# Altium schematic sheet microPower1.SchDoc
size A4
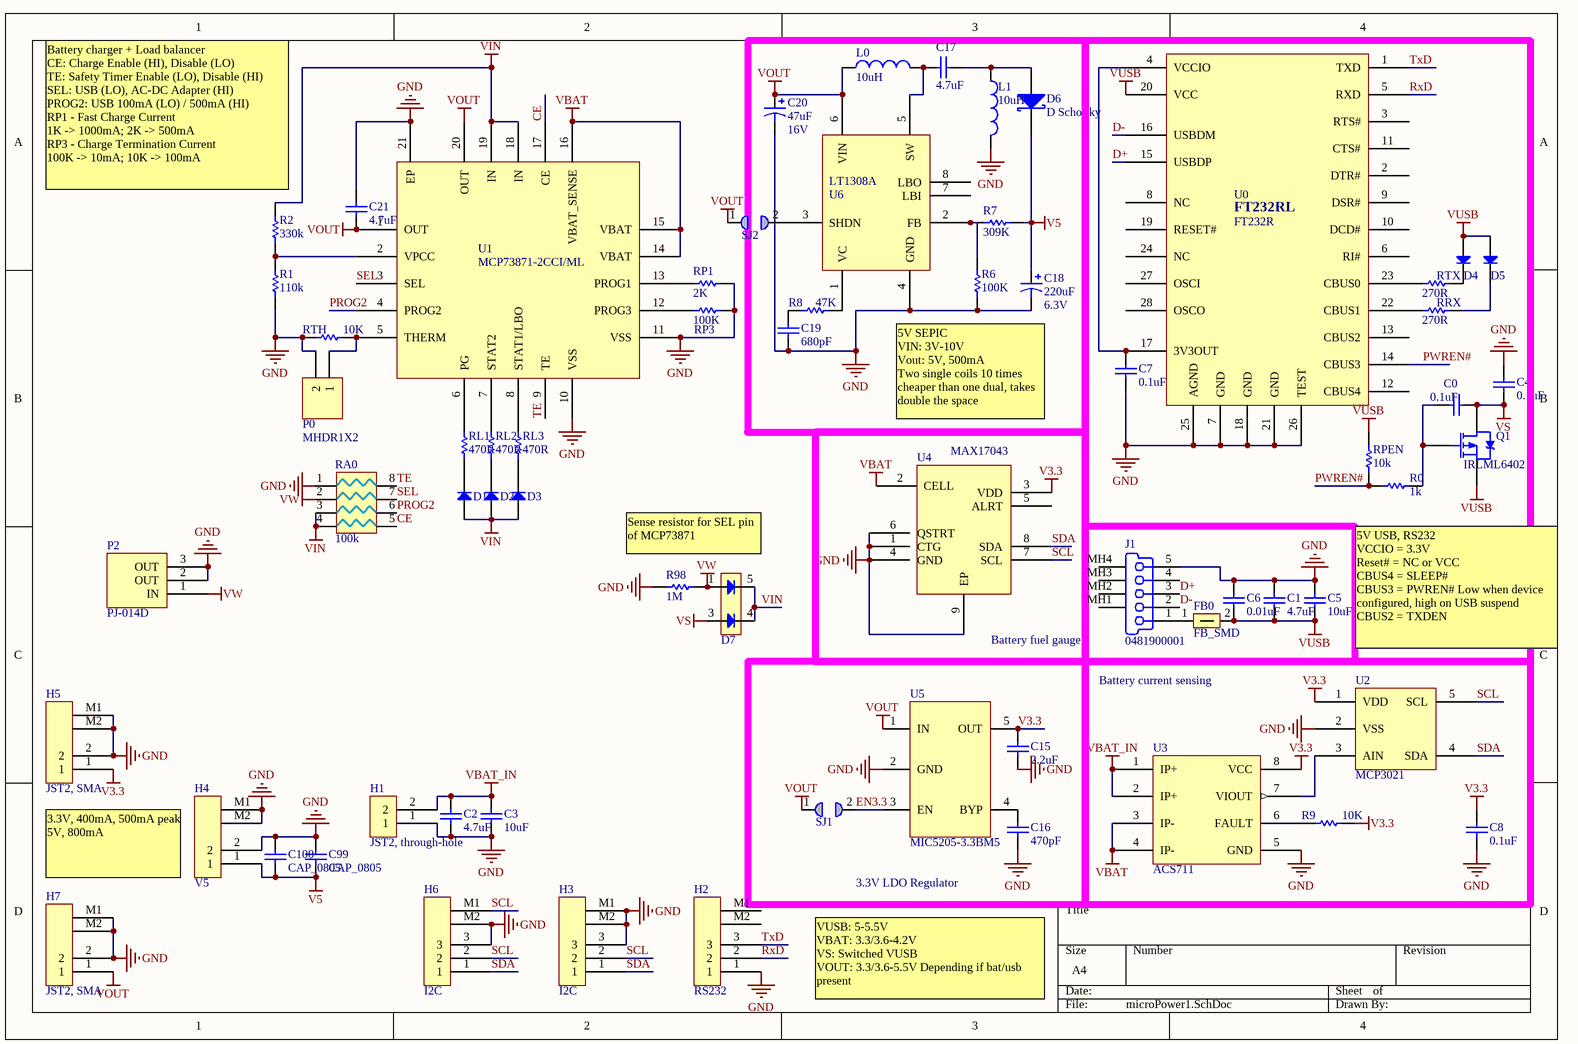
[diagram p0: microPower1.SchDoc]

## Parts
C0  0.1uF  [0603_CAP]
C1  4.7uF  [0805_CAP]
C2  4.7uF  [0805_CAP]
C3  10uF  [0805_CAP]
C4  0.1uF  [0603_CAP]
C5  10uF  [0805_CAP]
C6  0.01uF  [0603_CAP]
C7  0.1uF  [0603_CAP]
C8  0.1uF  [0603_CAP]
C15  2.2uF  [0603_CAP]
C16  470pF  [0603_CAP]
C17  4.7uF  [0805_CAP]
C18  220uF  Voltage: 6.3V  [CAPMP3528X21N]
C19  680pF  [0603_CAP]
C20  47uF  Voltage: 16V  [CAPMP6032X28N]
C21  4.7uF  [0805_CAP]
C99  CAP_0805  [CAP_0805]
C100  CAP_0805  [CAP_0805]
D1  (no value)  [0603_LED]
D2  (no value)  [0603_LED]
D3  (no value)  [0603_LED]
D4  (no value)  [0603_LED]
D5  (no value)  [0603_LED]
D6  D Schottky  [SMB]
D7  RB496EA  [SOT23-5]  (value not drawn)
FB0  FB_SMD  [0603_IND]
H1  JST2, through-hole  [JST B2B-PH-KL]
H2  RS232  [JST SHR-3V-S]
H3  I2C  [JST SHR-3V-S]
H4  V5  [JST SHR-2V-S]
H5  JST2, SMA  [JST SHR-2V-S]
H6  I2C  [JST SHR-3V-S]
H7  JST2, SMA  [JST SHR-2V-S]
J1  0481900001  [481900001]
L0  10uH  [INDP6060X45L]
L1  10uH  [INDP6060X45L]
P0  MHDR1X2  [MHDR1X2]
P2  PJ-014D  [PJ-014D]
Q1  IRLML6402  [Micro3_N]
R0  1k  [0603_RES]
R1  110k  [0603_RES]
R2  330k  [0603_RES]
R6  100K  [0603_RES]
R7  309K  [0603_RES]
R8  47K  [0603_RES]
R9  10K  [0603_RES]
R98  1M  [0603_RES]
RA0  100k  [RESCAXS80P320X150X60-8N]
RL1  470R  [0603_RES]
RL2  470R  [0603_RES]
RL3  470R  [0603_RES]
RP1  2K  [0603_RES]
RP3  100K  [0603_RES]
RPEN  10k  [0603_RES]
RRX  270R  [0603_RES]
RTH  10K  [0603_RES]
RTX  270R  [0603_RES]
SJ1  SJ  [0603_SJ]  (value not drawn)
SJ2  SJ  [0603_SJ]  (value not drawn)
U0  FT232R  [SOP65P780X200-28N]
U1  MCP73871-2CCI/ML  [MCP73871-2CCI/ML]
U2  MCP3021  [SOT23-5]
U3  ACS711  [SOP127P600X175-8M]
U4  MAX17043  [QFN50P300X200X80-8N]
U5  MIC5205-3.3BM5  [SOT95P280X130-5N]
U6  LT1308A  [SOP127P600X175-8N]

## Blocks framed on the sheet
Battery fuel gauge: U4
3.3V LDO Regulator: C15 C16 SJ1 U5
Battery current sensing: C8 R9 U2 U3

## Nets
GND: C1.2 C2.1 C3.1 C4.1 C5.2 C6.2 C7.1 C8.1 C15.2 C16.2 C18.2 C19.2 C20.2 C21.2 C99.1 C100.1 H1.1 H2.1 H3.3 H3.M1 H3.M2 H4.2 H4.M1 H4.M2 H5.2 H5.M1 H5.M2 H6.3 H6.M2 H7.2 H7.M1 H7.M2 J1.5(GND) L1.2 P0.2 P2.2(OUT) P2.3(OUT) R1.1 R6.1 R98.2 RA0.1 RP1.2 RP3.2 RTH.1 U0.7(GND) U0.18(GND) U0.21(GND) U0.25(AGND) U0.26(TEST) U1.10(VSS) U1.11(VSS) U1.21(EP) U2.2(VSS) U3.5(GND) U4.1(CTG) U4.4(GND) U4.6(QSTRT) U4.9(EP) U5.2(GND) U6.4(GND)
V3.3: C8.2 C15.1 H5.1 R9.2 U2.1(VDD) U3.8(VCC) U4.3(VDD) U5.5(OUT)
V5: C18.1 C99.2 C100.2 D6.2(K) H4.1 R7.1
VBAT: U1.14(VBAT) U1.15(VBAT) U1.16(VBAT_SENSE) U3.3(IP-) U3.4(IP-) U4.2(CELL)
VBAT_IN: C2.2 C3.2 H1.2 U3.1(IP+) U3.2(IP+)
VIN: D1.1(A) D2.1(A) D3.1(A) D7.4 D7.5 R2.1 RA0.3 RA0.4 U1.18(IN) U1.19(IN)
VOUT: C20.1 C21.1 H7.1 L0.1 SJ1.1 SJ2.1 U1.1(OUT) U1.20(OUT) U5.1(IN) U6.6(VIN)
VS: C0.2 C4.2 D7.3 Q1.3(D)
VUSB: C1.1 C5.1 C6.1 D4.1(A) D5.1(A) FB0.2 Q1.2(S) RPEN.1 U0.20(VCC)
VW: D7.1 P2.1(IN) R98.1 RA0.2
CE: RA0.5 U1.17(CE)
D+: J1.3(D+) U0.15(USBDP)
D-: J1.2(D-) U0.16(USBDM)
EN3.3: SJ1.2 U5.3(EN)
PROG2: RA0.6 U1.4(PROG2)
PWREN#: R0.1 RPEN.2 U0.14(CBUS3)
RxD: H2.2 U0.5(RXD)
SCL: H3.2 H6.2 H6.M1 U2.5(SCL) U4.7(SCL)
SDA: H3.1 H6.1 U2.4(SDA) U4.8(SDA)
SEL: RA0.7 U1.3(SEL)
TE: RA0.8 U1.9(TE)
TxD: H2.3 U0.1(TXD)
NetC0_1: C0.1 Q1.1(G) R0.2
NetC7_2: C7.2 U0.4(VCCIO) U0.17(3V3OUT)
NetC16_1: C16.1 U5.4(BYP)
NetC17_1: C17.1 L0.2 U6.5(SW)
NetC17_2: C17.2 D6.1(A) L1.1
NetC19_1: C19.1 R8.2
NetD1_2: D1.2(K) RL1.1
NetD2_2: D2.2(K) RL2.1
NetD3_2: D3.2(K) RL3.1
NetD4_2: D4.2(K) RTX.1
NetD5_2: D5.2(K) RRX.1
NetFB0_1: FB0.1 J1.1(V_BUS_(5V))
NetP0_1: P0.1 RTH.2 U1.5(THERM)
NetR1_2: R1.2 R2.2 U1.2(VPCC)
NetR6_2: R6.2 R7.2 U6.2(FB)
NetR8_1: R8.1 U6.1(VC)
NetR9_1: R9.1 U3.6(FAULT)
NetRL1_2: RL1.2 U1.6(PG)
NetRL2_2: RL2.2 U1.7(STAT2)
NetRL3_2: RL3.2 U1.8(STAT1/LBO)
NetRP1_1: RP1.1 U1.13(PROG1)
NetRP3_1: RP3.1 U1.12(PROG3)
NetRRX_2: RRX.2 U0.22(CBUS1)
NetRTX_2: RTX.2 U0.23(CBUS0)
NetSJ2_2: SJ2.2 U6.3(SHDN)
NetU2_3: U2.3(AIN) U3.7(VIOUT)

Not connected (* = marked no-connect by the designer): H2 M1 M2; J1 4(NC) MH1(Tab) MH2(Tab) MH3(Tab) MH4(Tab); U0 2(DTR#) 3(RTS#) 6(RI#) 8(NC) 9(DSR#) 10(DCD#) 11(CTS#) 12(CBUS4) 13(CBUS2) 19(RESET#) 24(NC) 27(OSCI) 28(OSCO); U4 5(ALRT); U6 7(LBI) 8(LBO)

## Notes on the sheet
- (near R2) Battery charger + Load balancer
  CE: Charge Enable (HI), Disable (LO)
  TE: Safety Timer Enable (LO), Disable (HI)
  SEL: USB (LO), AC-DC Adapter (HI)
  PROG2: USB 100mA (LO) / 500mA (HI)
  RP1 - Fast Charge Current
  1K -> 1000mA; 2K -> 500mA
  RP3 - Charge Termination Current
  100K -> 10mA; 10K -> 100mA
- 5V SEPIC
  VIN: 3V-10V
  Vout: 5V, 500mA
  Two single coils 10 times cheaper than one dual, takes double the space
- Sense resistor for SEL pin of MCP73871
- 5V USB, RS232
  VCCIO = 3.3V
  Reset# = NC or VCC
  CBUS4 = SLEEP#
  CBUS3 = PWREN# Low when device configured, high on USB suspend
  CBUS2 = TXDEN
- 3.3V, 400mA, 500mA peak
  5V, 800mA
- VUSB: 5-5.5V
  VBAT: 3.3/3.6-4.2V
  VS: Switched VUSB
  VOUT: 3.3/3.6-5.5V Depending if bat/usb present
- (in symbol FT232R) FT232RL

## Library data of the parts
C0 C4 C6-C8 C15 C16 C19 = CAP_0603
C1-C3 C5 C17 C21 = CAP_SMD: Chip Capacitor
C18 = T520B227M006ATE070: CAP TANT 220UF 6.3V 20% 1411
C20 = TR3C476K016C0300: CAP TANT 47UF 16V 10% 2312
D1-D5 = LED_SMD
D6 = D Schottky: Schottky Diode; Published: 8-Jun-2000; LatestRevisionDate: 17-Jul-2002; LatestRevisionNote: Re-released for DXP Platform.; PackageReference: SMB; Publisher: Altium Limited; PackageDescription: DO-214-AA/SMB; 2 C-Bend Leads; Body 5.3 x 3.6 mm, inc. leads (LxW); Code_JEDEC: DO-214-AA
D7 = RB496EA: Schottky barrier diode, 400mV @ 1A
H2 H3 H6 = JST3
H4 = JST2
J1 = 0481900001: USB On-The-Go (OTG) Mini-B Receptacle, Right Angle, SMT, 0.80mm (.031") Pitch, Solder Tabs with Back Cover, Recessed Type; PCB_Layout: Complies with Manufacturer's Recommendation.; Published: 21-Sep-2007; DatasheetVersion: revA, May-2004; PackageVersion: May-2004; PackageReference: 481900001; Publisher: Altium Limited; PackageDescription: USB Mini-B, Sinking Type, SM; 5 Position; Right Angle, Body 11.45 x 11.8 x 3.9 mm (LxWxH); ComponentLink1Description: Manufacturer Link; ComponentLink1URL: http://www.molex.com/; ComponentLink2Description: Datasheet; ComponentLink2URL: http://www.molex.com/cmc_upload/0/000/895/958/SD-48190-001RevA.pdf
L0 L1 = NR6045T100M: INDUCTOR 10UH 3A 20% SMD
P0 = MHDR1X2: Header, 2-Pin; LatestRevisionDate: 17-Jul-2002; LatestRevisionNote: Re-released for DXP Platform.; Publisher: Altium Limited
P2 = PJ-014D: Power jack, 4.2mm OD, 1.3mm ID, through-hole
Q1 = IRLML6401: HEXFET Power MOSFET; Published: 17-Sep-2003; DatasheetVersion: 2-Jul-2001; PackageVersion: Jul-2001; PackageReference: Micro3; Publisher: Altium Limited; PackageDescription: 3-Pin SOT-23 Package 0.95 mm Pitch, 2.3 mm Lead Span; ComponentLink1Description: Manufacturer Link; ComponentLink1URL: http://www.irf.com/; ComponentLink2Description: Datasheet; ComponentLink2URL: http://www.irf.com/product-info/datasheets/data/IRLML6401.pdf
R0-R2 R6-R9 R98 RL1-RL3 RP1 RP3 RPEN RRX RTH RTX = RES_SMD
RA0 = RES_ARR4: Resistor array, 4-Way, SMD
SJ1 SJ2 = SJ: Solder Joint
U4 = MAX17043: Compact, Low-Cost 1S/2S Fuel Gauges with Low-Battery Alert
U5 = MIC5205: Micrel MIC5205 LDO Voltage Regulator
U6 = LT1308: High Current, Micropower Single Cell, 600kHz  DC/DC Converters